# EAGLE design vending-machine-v2-arduino-shield-r1 (EAGLE 5.11)
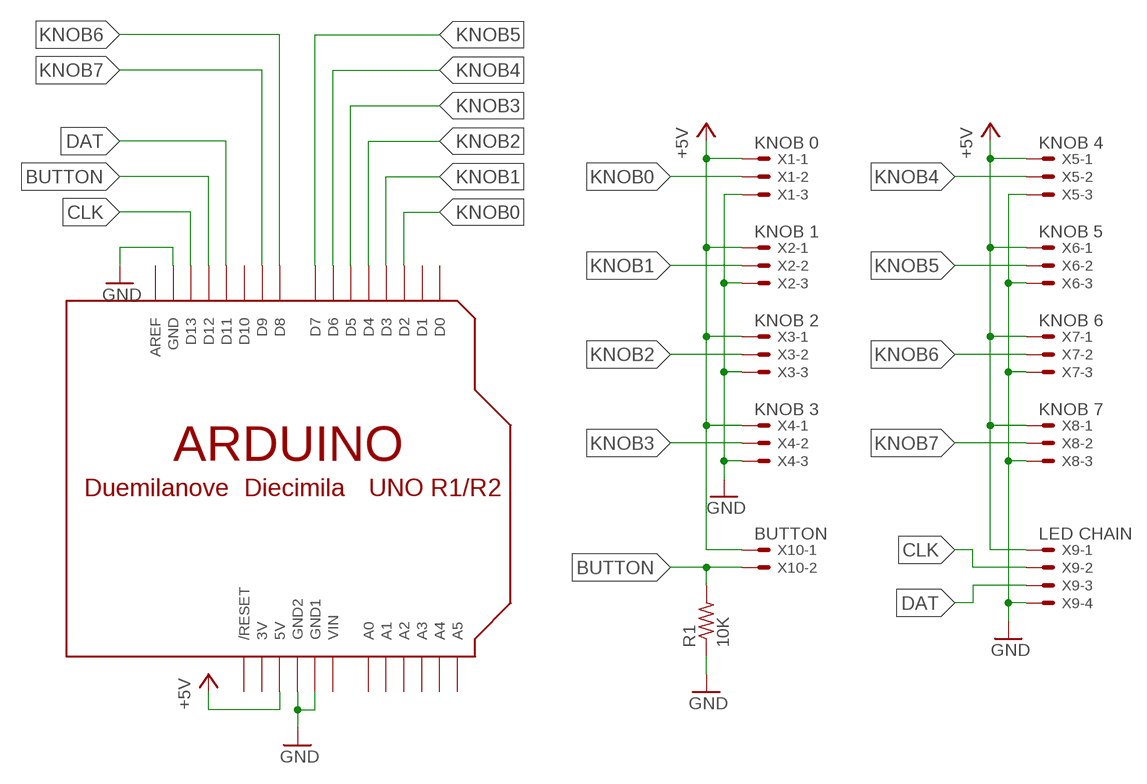
[diagram p0: schematic, sheet 1]

## Parts
R1  10K  R-US_0207/10  [0207/10]
U$1  ARDUINOUNO  [ARDUINO]
X1  KNOB 0  22-23-2031  [22-23-2031]
X2  KNOB 1  22-23-2031  [22-23-2031]
X3  KNOB 2  22-23-2031  [22-23-2031]
X4  KNOB 3  22-23-2031  [22-23-2031]
X5  KNOB 4  22-23-2031  [22-23-2031]
X6  KNOB 5  22-23-2031  [22-23-2031]
X7  KNOB 6  22-23-2031  [22-23-2031]
X8  KNOB 7  22-23-2031  [22-23-2031]
X9  LED CHAIN  22-23-2041  [22-23-2041]
X10  BUTTON  22-23-2021  [22-23-2021]

## Nets
+5V: U$1.5V X1.1 X2.1 X3.1 X4.1 X5.1 X6.1 X7.1 X8.1 X9.1 X10.1
BUTTON: R1.2 U$1.D12 X10.2
CLK: U$1.D13 X9.2
DAT: U$1.D11 X9.3
GND: R1.1 U$1.GND U$1.GND1 U$1.GND2 X1.3 X2.3 X3.3 X4.3 X5.3 X6.3 X7.3 X8.3 X9.4
KNOB0: U$1.D2 X1.2
KNOB1: U$1.D3 X2.2
KNOB2: U$1.D4 X3.2
KNOB3: U$1.D5 X4.2
KNOB4: U$1.D6 X5.2
KNOB5: U$1.D7 X6.2
KNOB6: U$1.D8 X7.2
KNOB7: U$1.D9 X8.2
Unconnected: U$1.A0 U$1.A1 U$1.A2 U$1.A3 U$1.A4 U$1.A5 U$1.AREF U$1.D0 U$1.D1 U$1.D10 U$1.RESET(/RESET)

## Power pins joined to a net without a drawn wire
3V: U$1.3V
VIN: U$1.VIN

## Library data of the parts
R1 = rcl:R-US_: RESISTOR, American symbol
U$1 = adafruit:ARDUINO: Arduino Diecimila/Duemilanove Make a shield with ease, this package has all the named pins as well as the two mounting drill holes and an outline of the USB and DC power connector. The outline is on the DIMENSION layer, so if your board house uses it they will cut the outline to match. http://www.ladyada.net/library/pcb/eaglelibrary.html
X1-X8 = con-molex:22-23-2031: .100" (2.54mm) Center Header - 3 Pin; MF: MOLEX; MPN: 22-23-2031; OC_FARNELL: 1462950; OC_NEWARK: 30C0862
X9 = con-molex:22-23-2041: .100" (2.54mm) Center Header - 4 Pin; MF: MOLEX; MPN: 22-23-2041; OC_FARNELL: 1462920; OC_NEWARK: 38C0355
X10 = con-molex:22-23-2021: .100" (2.54mm) Center Header - 2 Pin; MF: MOLEX; MPN: 22-23-2021; OC_FARNELL: 1462926; OC_NEWARK: 25C3832

## Board
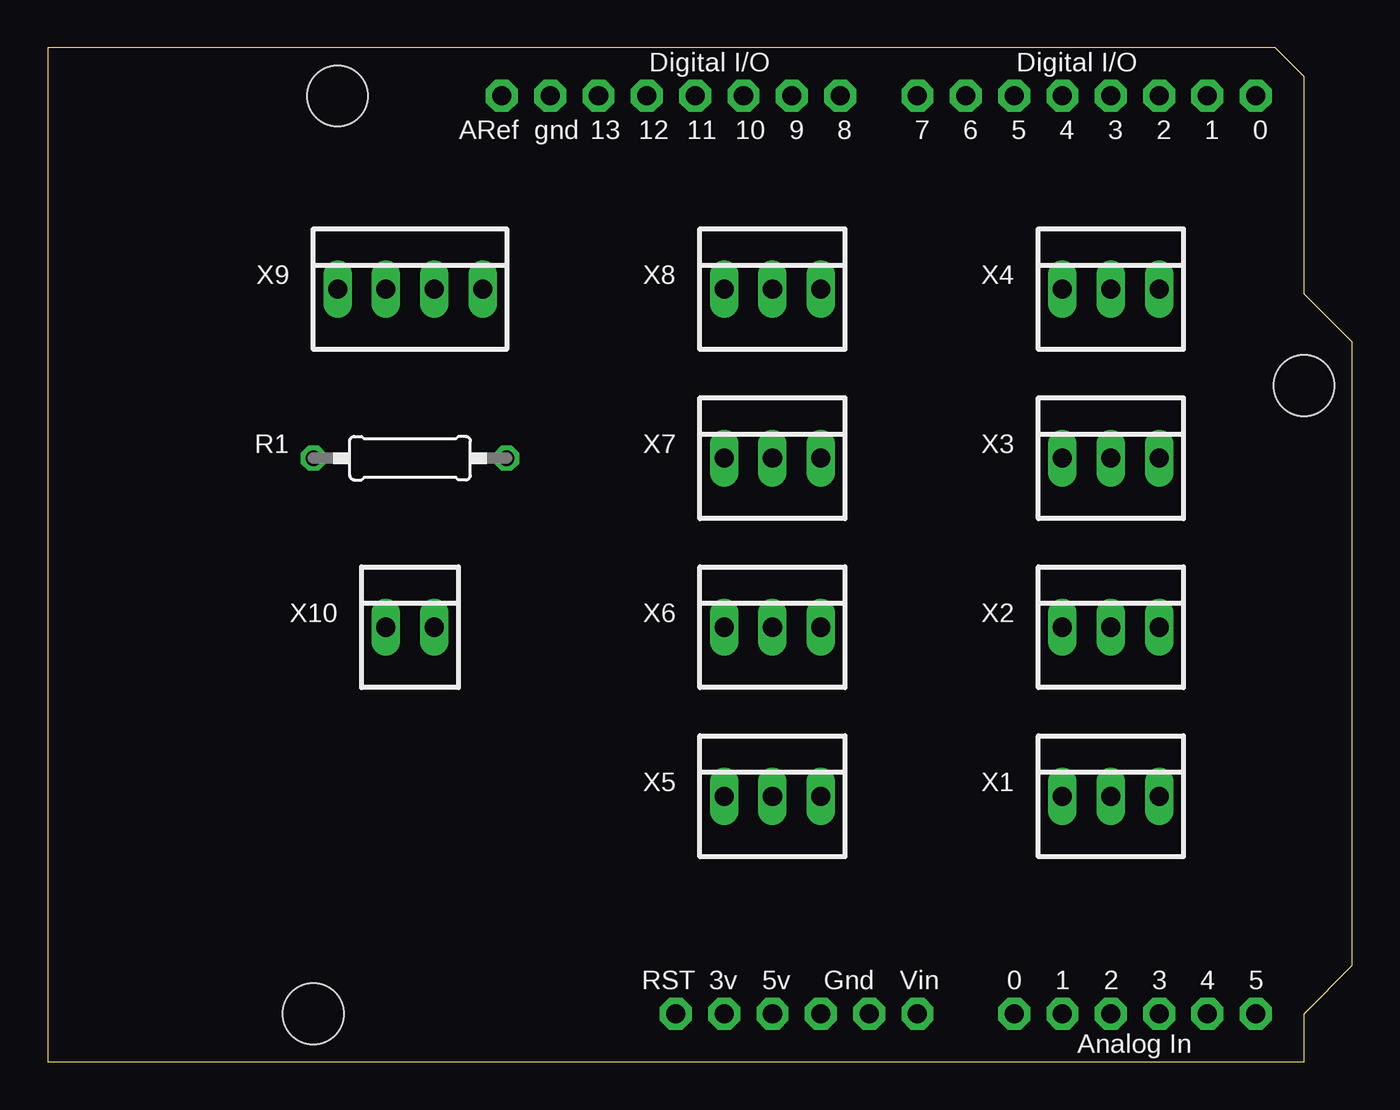
[diagram p1: board, top side]
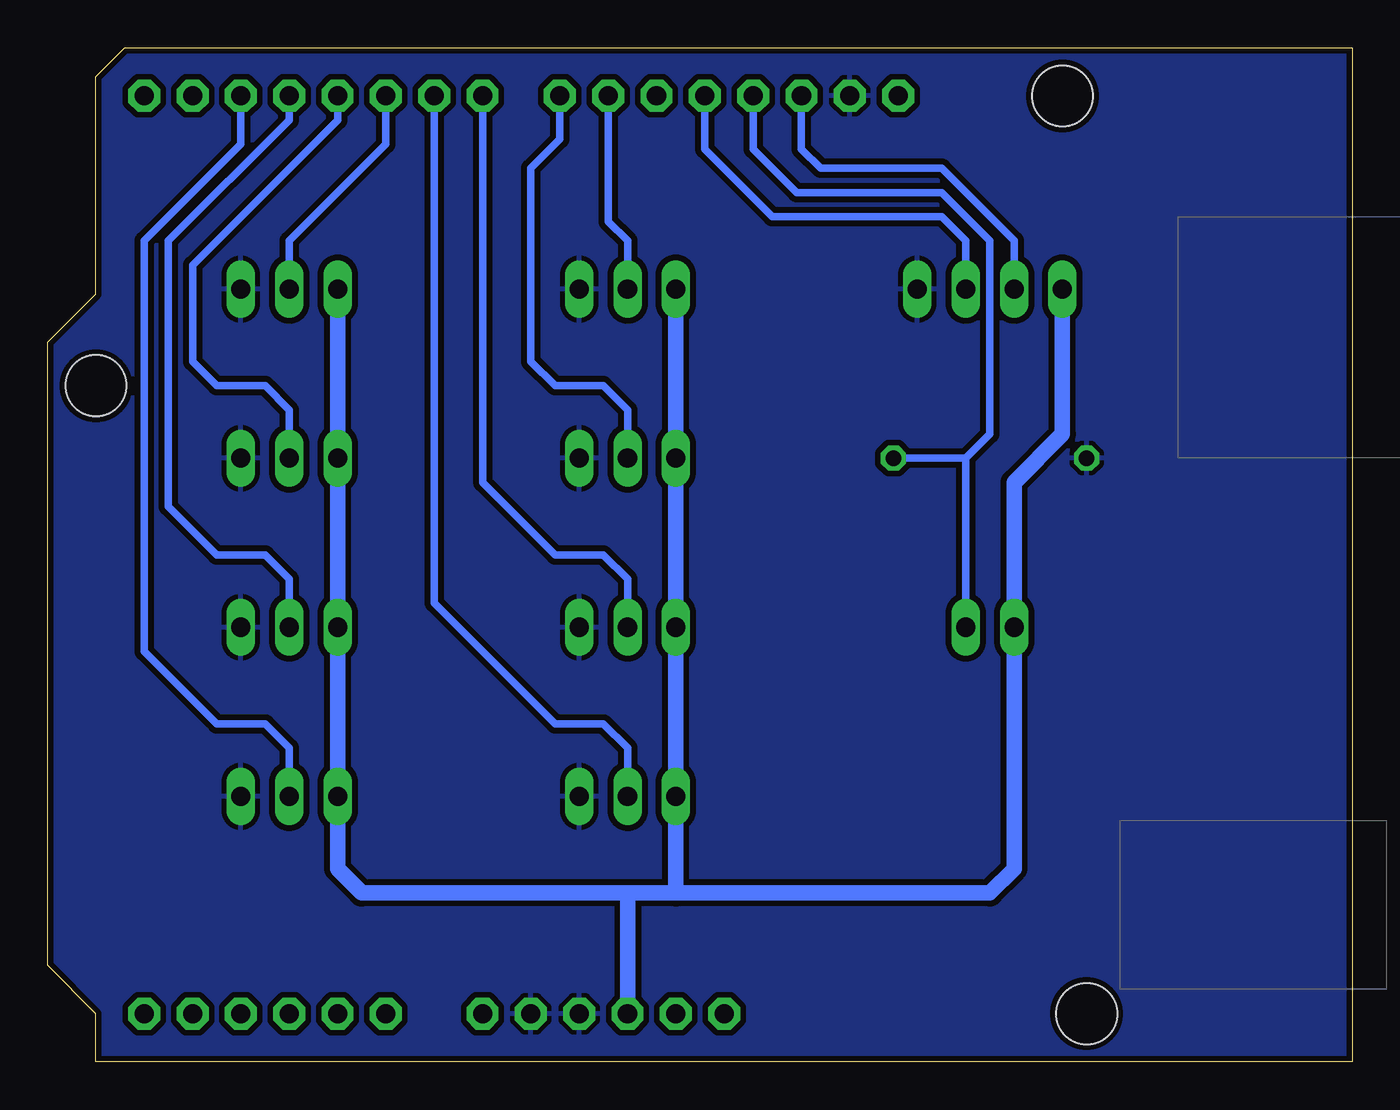
[diagram p2: board, bottom side, seen from below]

Size 68.58 x 53.34 mm. Coordinates in mm from the lower left corner, seen from the top.
Copper layers (1*16): Top 0.035mm / dielectric 1.5mm / Bottom 0.035mm
Design rules "default *": minimum track width 10mil, minimum drill 24mil, track to track 8mil, track to pad 8mil, pad to pad 8mil, via to via 8mil, smd to smd 8mil, copper to edge 10mil, drill to drill 8mil, minimum pad ring 10mil, minimum via ring 8mil, stop-mask expansion 4mil, vias tented up to drill 0mil, thermal gap 10mil

### Footprints (pad centres in the part's own frame; a part is rotated, then mirrored left to right if it is on the bottom)
0207/10 = drill 0.813 octagon: 1 -5.08,0; 2 5.08,0
ARDUINO = drill 1 pad 1.676 octagon: 3V 35.56,2.54; 5V 38.1,2.54; A0 50.8,2.54; A1 53.34,2.54; A2 55.88,2.54; A3 58.42,2.54; A4 60.96,2.54; A5 63.5,2.54; AREF 23.876,50.8; D0 63.5,50.8; D1 60.96,50.8; D2 58.42,50.8; D3 55.88,50.8; D4 53.34,50.8; D5 50.8,50.8; D6 48.26,50.8; D7 45.72,50.8; D8 41.656,50.8; D9 39.116,50.8; D10 36.576,50.8; D11 34.036,50.8; D12 31.496,50.8; D13 28.956,50.8; GND 26.416,50.8; GND1 43.18,2.54; GND2 40.64,2.54; RESET 33.02,2.54; VIN 45.72,2.54 | hole 3.2: 15.24,50.8; 66.04,35.56; 13.97,2.54
22-23-2031 = drill 1 long: 1 -2.54,0; 2 0,0; 3 2.54,0
22-23-2041 = drill 1 long: 1 -3.81,0; 2 -1.27,0; 3 1.27,0; 4 3.81,0
22-23-2021 = drill 1 long: 1 -1.27,0; 2 1.27,0

### Placement (x,y rotation side)
R1  19.05,31.75 0 top
U$1  0,0 0 top
X1  55.88,13.97 0 top
X2  55.88,22.86 0 top
X3  55.88,31.75 0 top
X4  55.88,40.64 0 top
X5  38.1,13.97 0 top
X6  38.1,22.86 0 top
X7  38.1,31.75 0 top
X8  38.1,40.64 0 top
X9  19.05,40.64 0 top
X10  19.05,22.86 0 top

### Tracks (layer width: path | path; a pad name or v marks a point on that pad's centre or on a via)
+5V
  Bottom 0.813: X8.1 X7.1 X6.1 X5.1 35.56,8.89 | X4.1 X3.1 X2.1 X1.1 53.34,10.16 52.07,8.89 38.1,8.89 | 38.1,8.89 U$1.5V | 35.56,8.89 38.1,8.89 | X9.1 15.24,33.02 17.78,30.48 X10.1 17.78,10.16 19.05,8.89 35.56,8.89
BUTTON
  Bottom 0.406: X10.2 20.32,31.75 | 20.32,31.75 19.05,33.02 19.05,43.18 21.59,45.72 29.21,45.72 31.5,48.01 U$1.D12 | 20.32,31.75 R1.2
CLK
  Bottom 0.406: U$1.D13 28.96,48.01 27.94,46.99 21.59,46.99 17.78,43.18 X9.2
DAT
  Bottom 0.406: U$1.D11 34.04,48.01 30.48,44.45 21.59,44.45 20.32,43.18 X9.3
GND
  pour Bottom (isolate 0.305): -1.27,54.61 69.85,54.61 69.85,-1.27 -1.27,-1.27
KNOB0
  Bottom 0.406: X1.2 55.88,16.51 57.15,17.78 59.69,17.78 63.5,21.59 63.5,43.18 58.42,48.26 U$1.D2
KNOB1
  Bottom 0.406: U$1.D3 55.88,49.53 62.23,43.18 62.23,29.21 59.69,26.67 57.15,26.67 55.88,25.4 X2.2
KNOB2
  Bottom 0.406: X3.2 55.88,34.29 57.15,35.56 59.69,35.56 60.96,36.83 60.96,41.91 53.34,49.53 U$1.D4
KNOB3
  Bottom 0.406: U$1.D5 50.8,48.26 55.88,43.18 X4.2
KNOB4
  Bottom 0.406: U$1.D6 48.26,24.13 41.91,17.78 39.37,17.78 38.1,16.51 X5.2
KNOB5
  Bottom 0.406: U$1.D7 45.72,30.48 41.91,26.67 39.37,26.67 38.1,25.4 X6.2
KNOB6
  Bottom 0.406: U$1.D8 41.66,48.51 43.18,46.99 43.18,36.83 41.91,35.56 39.37,35.56 38.1,34.29 X7.2
KNOB7
  Bottom 0.406: U$1.D9 39.12,44.2 38.1,43.18 X8.2